# Altium schematic sheet USB_OTG.SchDoc
size 420 x 297 mm; SheetNumber: 8; SheetTotal: 9
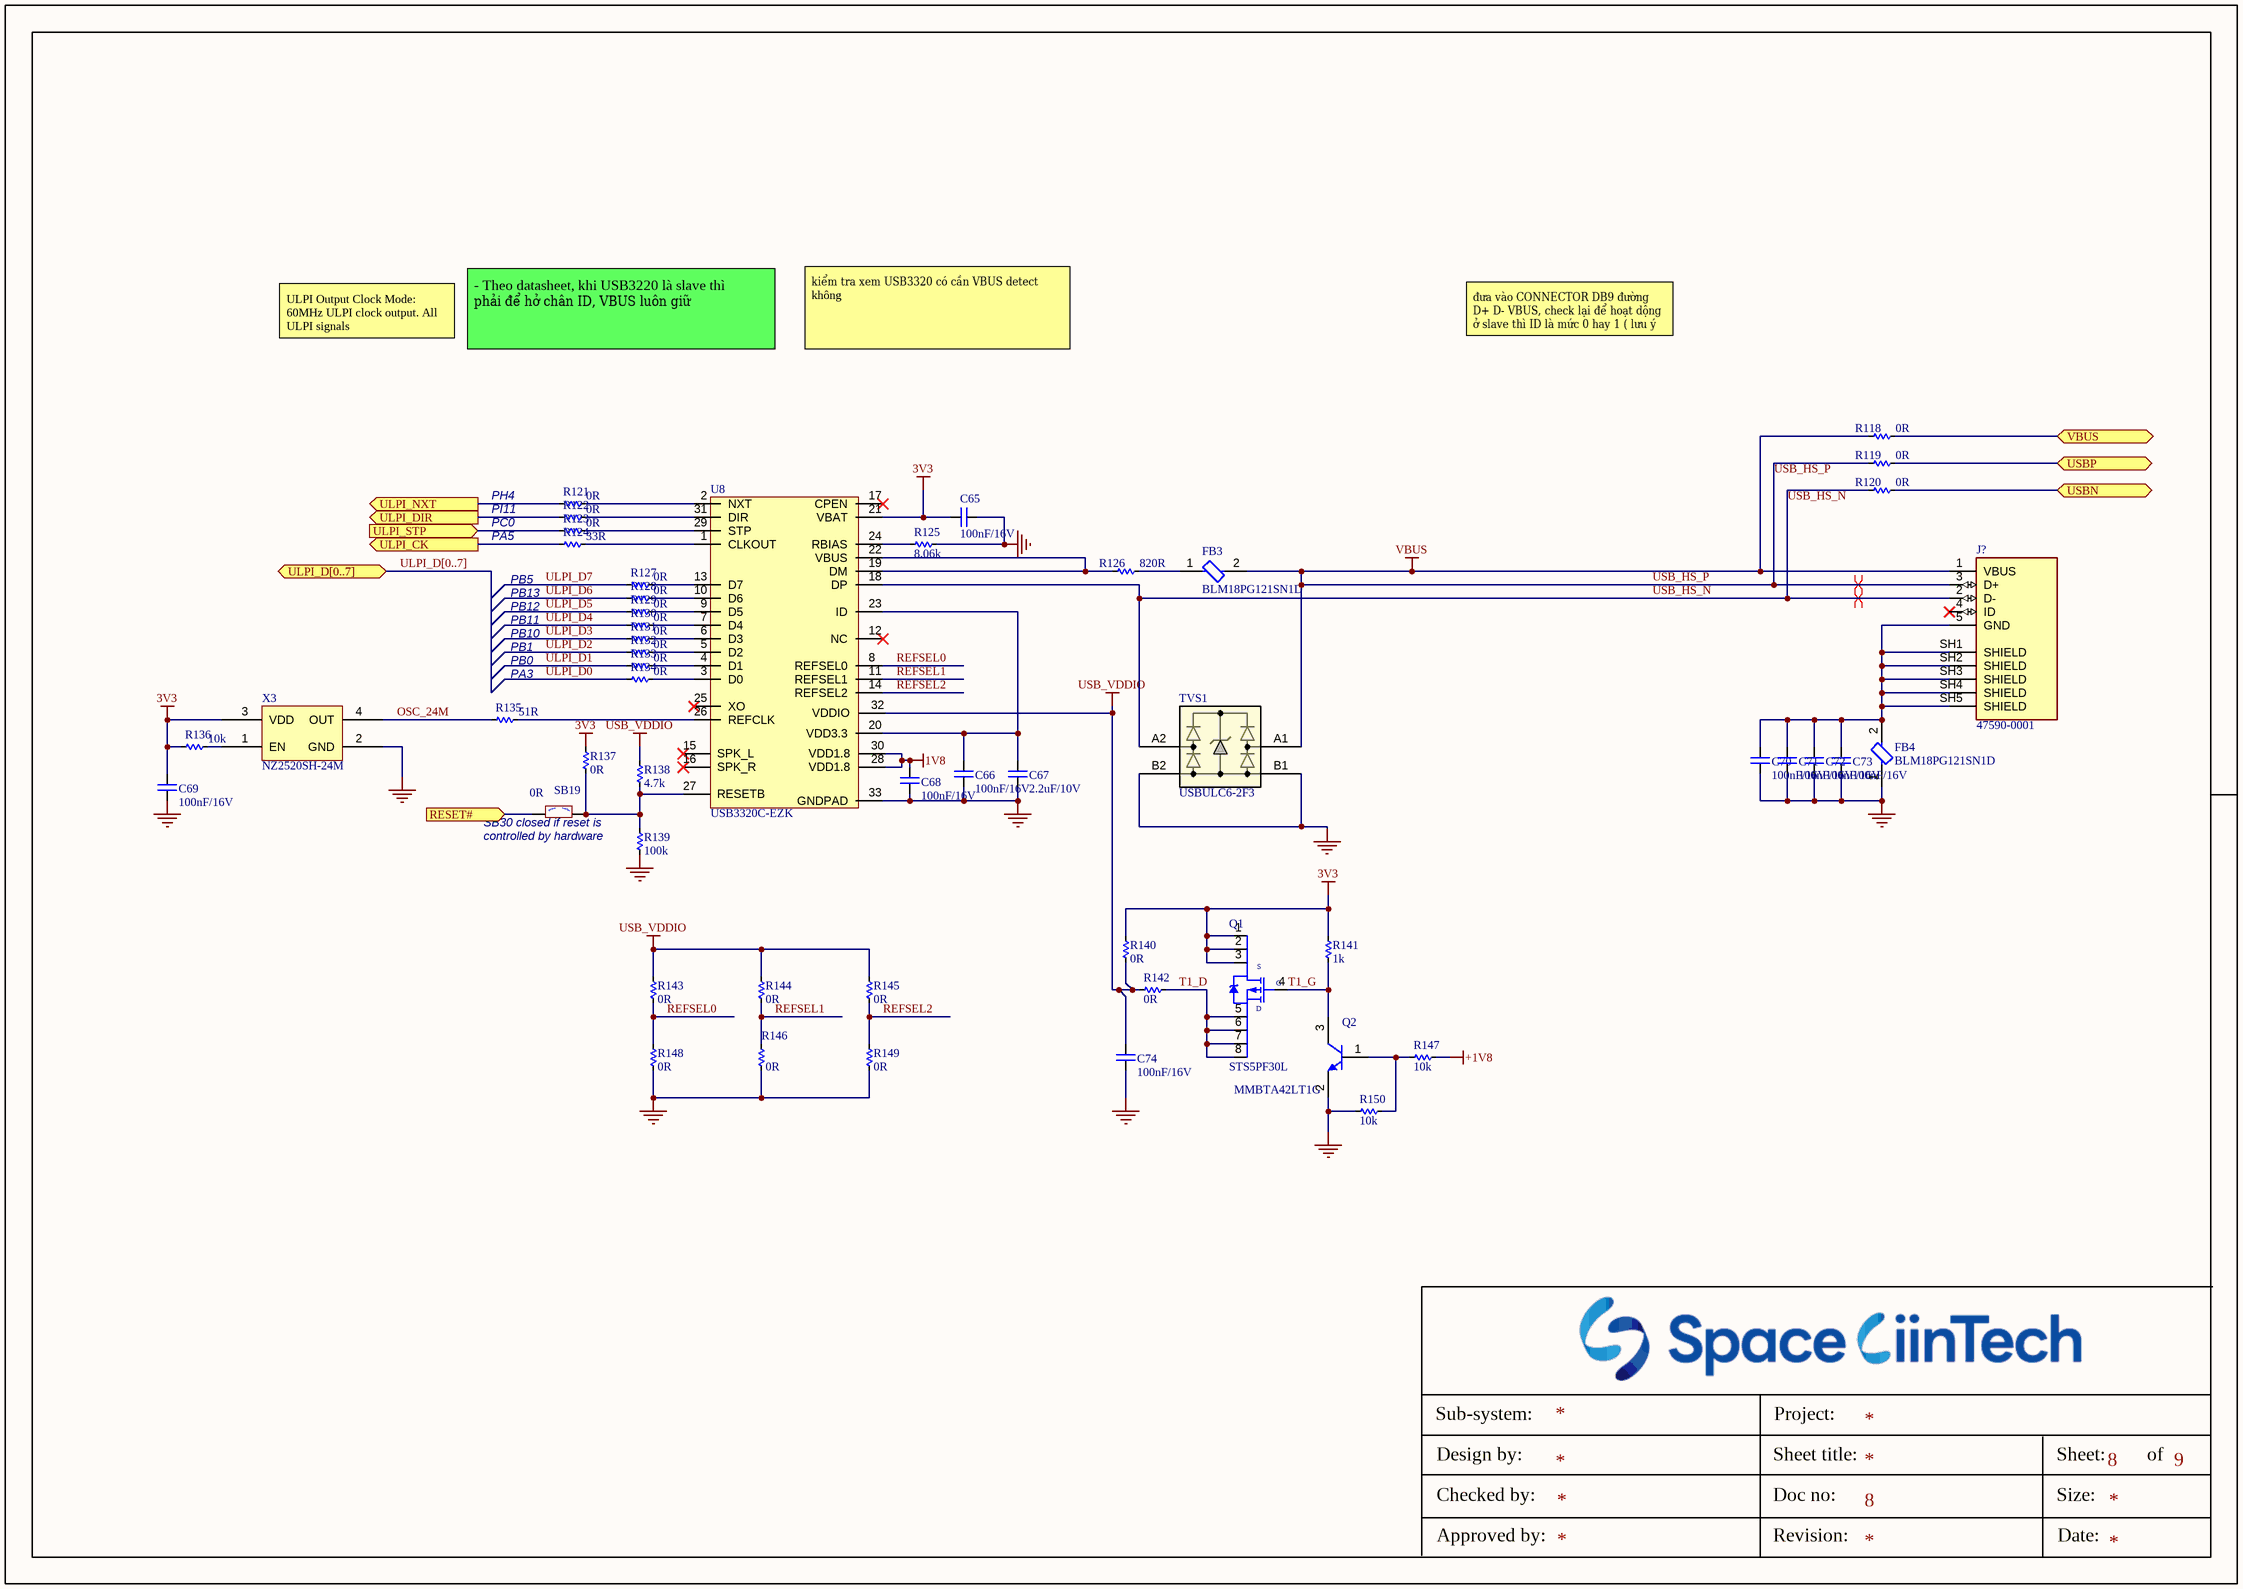
[diagram p0: USB_OTG.SchDoc]

## Parts
C65  100nF/16V  [CAP_C_1608X80]
C66  100nF/16V  [CAP_C_1608X80]
C67  2.2uF/10V  [CAP_C_1608X80]
C68  100nF/16V  [CAP_C_1608X80]
C69  100nF/16V  [CAP_C_1608X80]
C70  100nF/16V  [CAP_C_1608X80]
C71  100nF/16V  [CAP_C_1608X80]
C72  100nF/16V  [CAP_C_1608X80]
C73  100nF/16V  [CAP_C_1608X80]
C74  100nF/16V  [CAP_C_1608X80]
FB3  BLM18PG121SN1D  [FP-BLM18-0_15-t0_8-IPC_A]
FB4  BLM18PG121SN1D  [FP-BLM18-0_15-t0_8-IPC_A]
J?  47590-0001  [MOLEX_47590-0001]
Q1  STS5PF30L  [SO-8_STM]
Q2  MMBTA42LT1G  [ONSC-SOT-23-3-318-08_V]
R118  0R  [RES_C_1608X60]
R119  0R  [RES_C_1608X60]
R120  0R  [RES_C_1608X60]
R121  0R  [RES_C_1608X60]
R122  0R  [RES_C_1608X60]
R123  0R  [RES_C_1608X60]
R124  33R  [RES_C_1608X60]
R125  8.06k  [RES_C_1608X60]
R126  820R  [RES_C_1608X60]
R127  0R  [RES_C_1608X60]
R128  0R  [RES_C_1608X60]
R129  0R  [RES_C_1608X60]
R130  0R  [RES_C_1608X60]
R131  0R  [RES_C_1608X60]
R132  0R  [RES_C_1608X60]
R133  0R  [RES_C_1608X60]
R134  0R  [RES_C_1608X60]
R135  51R  [RES_C_1608X60]
R136  10k  [RES_C_1608X60]
R137  0R  [RES_C_1608X60]
R138  4.7k  [RES_C_1608X60]
R139  100k  [RES_C_1608X60]
R140  0R  [RES_C_1608X60]
R141  1k  [RES_C_1608X60]
R142  0R  [RES_C_1608X60]
R143  0R  [RES_C_1608X60]
R144  0R  [RES_C_1608X60]
R145  0R  [RES_C_1608X60]
R146  0R  [RES_C_1608X60]
R147  10k  [RES_C_1608X60]
R148  0R  [RES_C_1608X60]
R149  0R  [RES_C_1608X60]
R150  10k  [RES_C_1608X60]
SB19  value 0R  [Jump2]  (hidden comment: SB_OFF)
TVS1  USBULC6-2F3  [FLIPCHIP4_USBUL_STM]
U8  USB3320C-EZK  [QFN32_5X5MC_MCH]
X3  NZ2520SH-24M  [NZ2520SH-24M]

## Ports
RESET# (in), ULPI_CK (out), ULPI_D[0..7] (bidir), ULPI_DIR (out), ULPI_NXT (out), ULPI_STP (in), USBN (bidir), USBP (bidir), VBUS (bidir)

## Nets
1V8: C68.2 U8.28(VDD1.8) U8.30(VDD1.8)
3V3: C65.2 C69.2 Q1.1(S) Q1.2(S) Q1.3(S) R136.2 R137.1 R140.1 R141.1 U8.21(VBAT) X3.3(VDD)
+1V8: R147.2
GND: C65.1 C66.1 C67.1 C68.1 C69.1 C70.1 C71.1 C72.1 C73.1 C74.1 FB4.1 Q2.2(E) R125.2 R139.2 R146.2 R148.2 R149.2 R150.1 TVS1.B1 TVS1.B2 U8.33(GNDPAD) X3.2(GND)
USB_HS_P: FB3.2 J?.1(VBUS) J?.3(D+) R118.1 R119.1 TVS1.A1  [also labelled VBUS]
USB_VDDIO: C74.2 R138.1 R140.2 R142.1 R143.1 R144.1 R145.1 U8.32(VDDIO)
OSC_24M: R135.2 X3.4(OUT)
REFSEL0: R143.2 R148.1 U8.8(REFSEL0)
REFSEL1: R144.2 R146.1 U8.11(REFSEL1)
REFSEL2: R145.2 R149.1 U8.14(REFSEL2)
RESET#: SB19.1 ; port RESET#
T1_D: Q1.5(D) Q1.6(D) Q1.7(D) Q1.8(D) R142.2
T1_G: Q1.4(G) Q2.3(C) R141.2
ULPI_CK: R124.2 ; port ULPI_CK
ULPI_D0: R134.2
ULPI_D1: R133.2
ULPI_D2: R132.2
ULPI_D3: R131.2
ULPI_D4: R130.2
ULPI_D5: R129.2
ULPI_D6: R128.2
ULPI_D7: R127.2
ULPI_DIR: R122.2 ; port ULPI_DIR
ULPI_NXT: R121.2 ; port ULPI_NXT
ULPI_STP: R123.2 ; port ULPI_STP
USB_HS_N: J?.2(D-) R120.1 TVS1.A2 U8.18(DP)
USBN: R120.2 ; port USBN
USBP: R119.2 ; port USBP
VBUS: R118.2 ; port VBUS
NetC66_2: C66.2 C67.2 U8.20(VDD3.3) U8.23(ID)
NetC70_2: C70.2 C71.2 C72.2 C73.2 FB4.2 J?.5(GND) J?.SH1(SHIELD) J?.SH2(SHIELD) J?.SH3(SHIELD) J?.SH4(SHIELD) J?.SH5(SHIELD)
NetFB3_1: FB3.1 R126.2
NetQ2_1: Q2.1(B) R147.1 R150.2
NetR121_1: R121.1 U8.2(NXT)
NetR122_1: R122.1 U8.31(DIR)
NetR123_1: R123.1 U8.29(STP)
NetR124_1: R124.1 U8.1(CLKOUT)
NetR125_1: R125.1 U8.24(RBIAS)
NetR126_1: R126.1 U8.19(DM) U8.22(VBUS)
NetR127_1: R127.1 U8.13(D7)
NetR128_1: R128.1 U8.10(D6)
NetR129_1: R129.1 U8.9(D5)
NetR130_1: R130.1 U8.7(D4)
NetR131_1: R131.1 U8.6(D3)
NetR132_1: R132.1 U8.5(D2)
NetR133_1: R133.1 U8.4(D1)
NetR134_1: R134.1 U8.3(D0)
NetR135_1: R135.1 U8.26(REFCLK)
NetR136_1: R136.1 X3.1(EN)
NetR137_2: R137.2 R138.2 R139.1 SB19.2 U8.27(RESETB)

Not connected (* = marked no-connect by the designer): J? 4(ID)*; U8 12(NC)* 15(SPK_L)* 16(SPK_R)* 17(CPEN)* 25(XO)*

## Buses and harness runs
bus ULPI_D[0..7] = port ULPI_D[0..7]

## Layout directives
differential pair: USB_HS_N, USB_HS_P

## Notes on the sheet
- ULPI Output Clock Mode:
  60MHz ULPI clock output. All ULPI signals
  are driven sync
- - Theo datasheet, khi USB3220 là slave thì phải để hở chân ID, VBUS luôn giữ
- kiểm tra xem USB3320 có cần VBUS detect không
- đưa vào CONNECTOR DB9 đường D+ D- VBUS, check lại để hoạt dộng ở slave thì ID là mức 0 hay 1 ( lưu ý là con usb3320 luôn ở slave)
- PH4
- PI11
- PC0
- PA5
- PB13
- PB5
- (near R135) PB0
- PB1
- PB10
- PB11
- PB12
- (near R135) PA3
- (near SB19) SB30 closed if reset is
- controlled by hardware
- Sub-system:
- Design by:
- Sheet title:
- Project:
- Sheet:
- of
- Checked by:
- Approved by:
- Doc no:
- Revision:
- Size:
- Date:

## Library data of the parts
C65-C74 = CAP_SMD: CAP_Chip; Value: 33pF
FB3 FB4 = CMP-0686-00557-7: Chip Ferrite Bead, 0603, 120Ω @ 100MHz, 0.05Ω, 25%, 2A; Impedance: 120R; Number of Circuits: 1; Shielding: Unshielded; Material: Steel; DC Resistance (DCR): 50mR; Case Code (Imperial): 0603; RoHS Compliant: Yes; Number of Pins: 2; Min Operating Temperature: -55°C; Case Code (Metric): 1608; Frequency: 100MHz; Length: 1.6mm; Test Frequency: 100MHz; Max Operating Temperature: 125°C; Packaging: Tape and Reel; Max Current Rating: 2A; Termination: SMD/SMT; Lead Free: Lead Free; Max DC Current: 2A; Case/Package: 0603; Height: 0.8mm; Current Rating: 2A; Radiation Hardening: No; Core Material: Ferrite; DC Current: 2A; REACH SVHC: No SVHC; Package Quantity: 1; Depth: 0.8mm; Number of Lines: 1; Tolerance: 25%; Width: 0.8mm
J? = 47590-0001: RightAngle SMT TypeABVersion 2.0 Micro USB Conn Skt,30Vac,1.8A 47650 MICRO-USB | Molex Incorporated 47590-0001; SnapEDA_Link: https://www.snapeda.com/parts/47590-0001/Molex/view-part/?ref=snap; Package: None; Value: *; MF: Molex; MP: 47590-0001; Check_prices: https://www.snapeda.com/parts/47590-0001/Molex/view-part/?ref=eda
Q2 = CMP-1048-00662-1: High Voltage Transistor, NPN Silicon, 3-Pin SOT-23, Pb-Free, Tape and Reel; Manufacturer: On Semiconductor; fT Min (MHz): 50; IC Continuous (A): 0.5; ComponentLink1URL: http://www.onsemi.com/; ComponentLink3URL: http://www.onsemi.cn/pub_link/Collateral/318-08.PDF; RoHS: TRUE; ComponentLink2Description: Datasheet; PartNumber: MMBTA42LT1G; Polarity: NPN; DatasheetVersion: Rev. 12; PackageReference: SOT-23-3-318-08; PackageDescription: 3-Pin Small Outline Transistor, Body 2.92 x 1.3 mm, Pitch 0.95 mm; ComponentLink3Description: Package Specification; ComponentLink1Description: Manufacturer URL; Packing: Tape and Reel; PackageVersion: Rev. AP, 11/2009; Mounting Technology: Surface Mount; ComponentLink2URL: http://www.onsemi.cn/pub_link/Collateral/MMBTA42LT1-D.PDF
R118-R120 = _RES_B_2: RES, 0603
R121-R150 = _RES_B_2: RES
SB19 = MCD-00072: Solder Bridge OFF; Part_Type: Resistor; Manufacturer: YAGEO; Manufacturer_HQ_COO: Unknown; Manufacturer_Part_Number: RC0603JR-070RL; Part_Preference: Recommended; Initial_Board_Reference: mb1274; Component_Country_Of_Origin: China; ID: 2520; Order_Code_RS: 199-5647; ShowFields: YES; Internal_Part_Number: MCD-00072; Status: Released; ECCN_US: n/a; ECCN_EU: n/a; Provided_By: n/a; ComponentLink1URL: http://tunmcdsvn.tun.st.com/Component_Documentation_Library/Trunk/Resistor/YAGEO_RC_Series; Order_Code_Digikey: 311-0.0GRTR-ND; Order_Code_Farnell: 2421846; Package: 0603
TVS1 = USBULC6-2F3: No Description Available; Manufacturer_Name: STMicroelectronics; Copyright: Copyright (C) 2025 Ultra Librarian. All rights reserved.; Manufacturer_Part_Number: USBULC6-2F3; RefDes: RefDes; Type: Type
U8 = USB3320C-EZK: USB3320C,  Hi-Speed USB Host, Device or OTG PHY with ULPI Low Pin Interface; Manuf_1: MICROCHIP; Manuf_Part_1: USB3320C-EZK-TR; Fitted: YES; Ordered by: Subcon; ECCN_US/EU: EAR99/NEC